# Altium project Heavy Duty Tarocco Motor Driver.PrjPCB
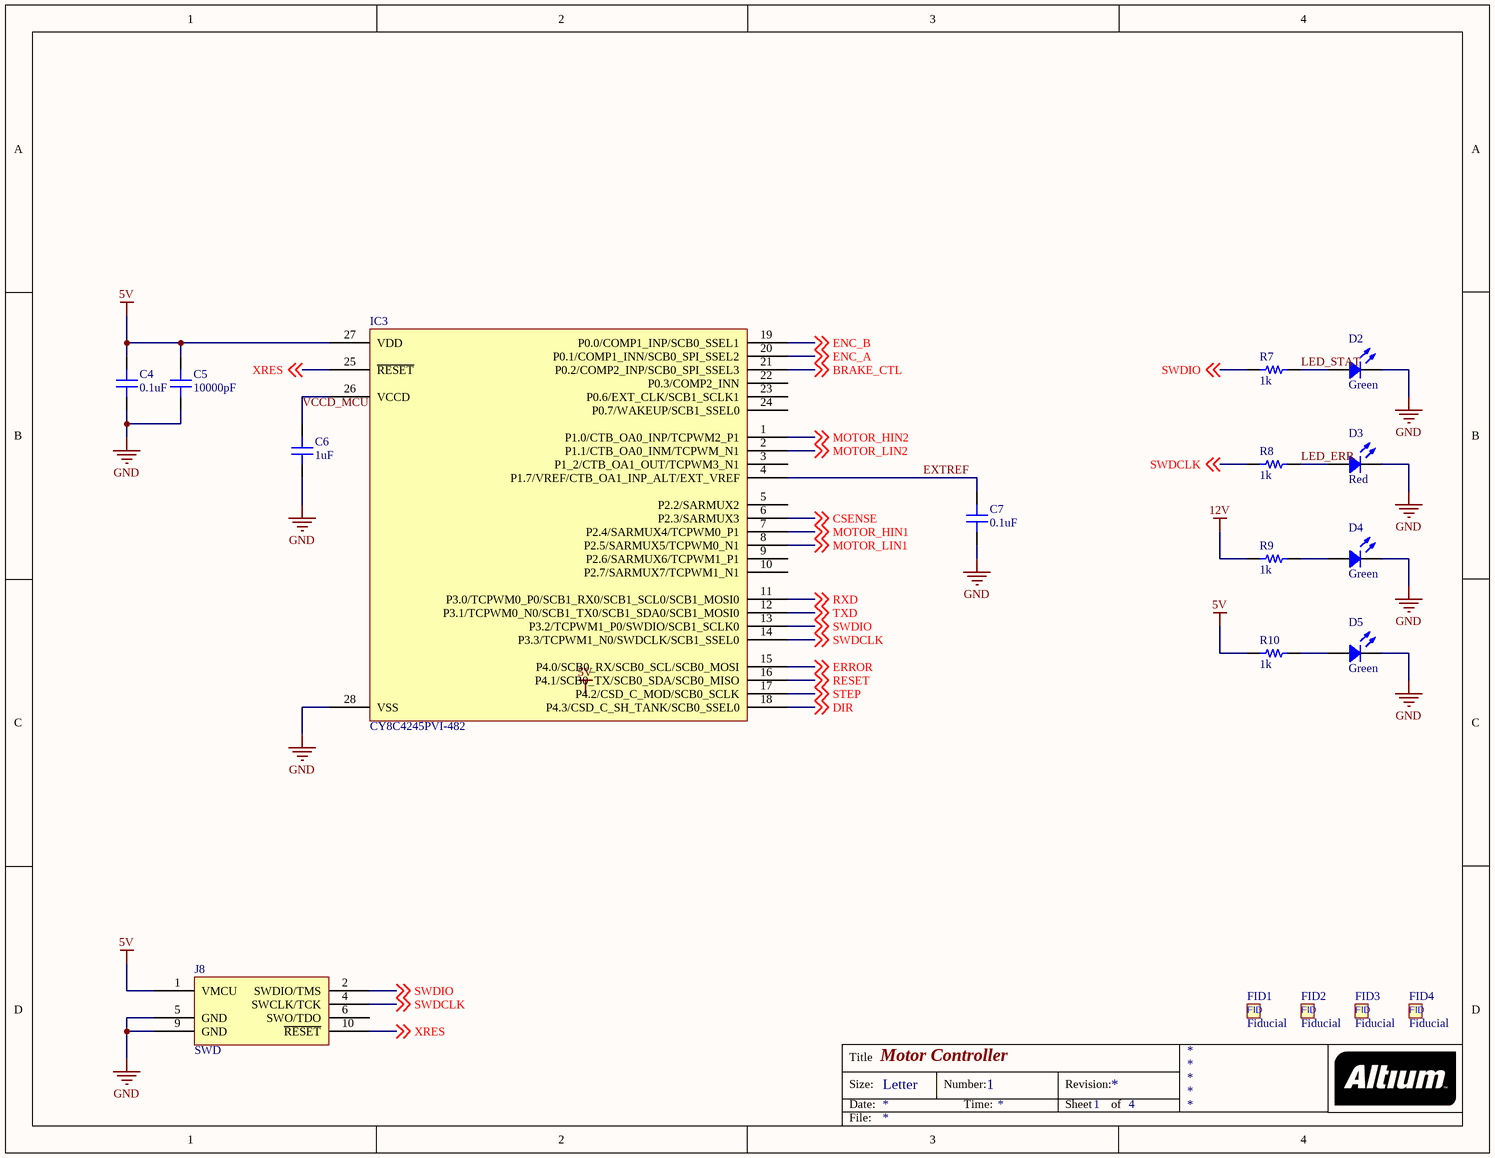
[diagram p0: Controller.SchDoc]
4 sheets, 121 parts. Net scope: global (net labels, ports and power ports of the same name join across sheets).
Board file: Motor Control Board.PcbDoc
Sheets:
  Controller.SchDoc
  HBridge.SchDoc
  Connectors.SchDoc
  Power Supply.SchDoc

## Sheet Controller.SchDoc: Motor Controller
size Letter; DocumentNumber: 1; SheetNumber: 1; SheetTotal: 4

### Parts
C4  0.1uF  [CAP 0603/1608]
C5  10000pF  [CAP 0603/1608]
C6  1uF  [CAP 0603/1608]
C7  0.1uF  [CAP 0603/1608]
D2  Green  [LED 0603/1608 GREEN]
D3  Red  [LED 0603/1608 RED]
D4  Green  [LED 0603/1608 GREEN]
D5  Green  [LED 0603/1608 GREEN]
FID1  Fiducial  [Fiducial]  (no BOM)
FID2  Fiducial  [Fiducial]  (no BOM)
FID3  Fiducial  [Fiducial]  (no BOM)
FID4  Fiducial  [Fiducial]  (no BOM)
IC3  CY8C4245PVI-482  [CYPRESS SSOP-28 210MIL]
J8  SWD  [10 Pin SWD]  (no BOM)
R7  1k  [RES 0603/1608]
R8  1k  [RES 0603/1608]
R9  1k  [RES 0603/1608]
R10  1k  [RES 0603/1608]

### Nets
5V: C4.2 C5.2 IC3.27(VDD) J8.1(VMCU) R10.1
12V: R9.1
GND: C4.1 C5.1 C6.1 C7.1 D2.2 D3.2 D4.2 D5.2 IC3.28(VSS) J8.5(GND) J8.9(GND)
BRAKE_CTL: IC3.21(P0.2/COMP2_INP/SCB0_SPI_SSEL3) ; off-sheet BRAKE_CTL
CSENSE: IC3.6(P2.3/SARMUX3) ; off-sheet CSENSE
DIR: IC3.18(P4.3/CSD_C_SH_TANK/SCB0_SSEL0) ; off-sheet DIR
ENC_A: IC3.20(P0.1/COMP1_INN/SCB0_SPI_SSEL2) ; off-sheet ENC_A
ENC_B: IC3.19(P0.0/COMP1_INP/SCB0_SSEL1) ; off-sheet ENC_B
ERROR: IC3.15(P4.0/SCB0_RX/SCB0_SCL/SCB0_MOSI) ; off-sheet ERROR
EXTREF: C7.2 IC3.4(P1.7/VREF/CTB_OA1_INP_ALT/EXT_VREF)
LED_ERR: D3.1 R8.2
LED_STAT: D2.1 R7.2
MOTOR_HIN1: IC3.7(P2.4/SARMUX4/TCPWM0_P1) ; off-sheet MOTOR_HIN1
MOTOR_HIN2: IC3.1(P1.0/CTB_OA0_INP/TCPWM2_P1) ; off-sheet MOTOR_HIN2
MOTOR_LIN1: IC3.8(P2.5/SARMUX5/TCPWM0_N1) ; off-sheet MOTOR_LIN1
MOTOR_LIN2: IC3.2(P1.1/CTB_OA0_INM/TCPWM_N1) ; off-sheet MOTOR_LIN2
RESET: IC3.16(P4.1/SCB0_TX/SCB0_SDA/SCB0_MISO) ; off-sheet RESET
RXD: IC3.11(P3.0/TCPWM0_P0/SCB1_RX0/SCB1_SCL0/SCB1_MOSI0) ; off-sheet RXD
STEP: IC3.17(P4.2/CSD_C_MOD/SCB0_SCLK) ; off-sheet STEP
SWDCLK: IC3.14(P3.3/TCPWM1_N0/SWDCLK/SCB1_SSEL0) J8.4(SWCLK/TCK) R8.1 ; off-sheet SWDCLK
SWDIO: IC3.13(P3.2/TCPWM1_P0/SWDIO/SCB1_SCLK0) J8.2(SWDIO/TMS) R7.1 ; off-sheet SWDIO
TXD: IC3.12(P3.1/TCPWM0_N0/SCB1_TX0/SCB1_SDA0/SCB1_MOSI0) ; off-sheet TXD
VCCD_MCU: C6.2 IC3.26(VCCD)
XRES: IC3.25(~{RESET}) J8.10(~{RESET}) ; off-sheet XRES
NetD4_1: D4.1 R9.2
NetD5_1: D5.1 R10.2

Not connected (* = marked no-connect by the designer): IC3 3(P1_2/CTB_OA1_OUT/TCPWM3_N1) 5(P2.2/SARMUX2) 9(P2.6/SARMUX6/TCPWM1_P1) 10(P2.7/SARMUX7/TCPWM1_N1) 22(P0.3/COMP2_INN) 23(P0.6/EXT_CLK/SCB1_SCLK1) 24(P0.7/WAKEUP/SCB1_SSEL0); J8 6(SWO/TDO)

### Notes on the sheet
- Labels drawn without touching a wire or pin: 5V
- Title
- Size:
- Date:
- Letter
- Number:
- Time:
- Revision:
- Sheet
- of
- File:
- (in symbol Fiducial) FID

### Library data of the parts
C4 = CC0603KPX7R7BB104: CAP CER 0.1UF 16V X7R 0603; Manufacturer: Yageo; TemperatureRange: -55C ~ 125C; Tolerance: 10%; Value: 0.1uF; Part Number: CC0603KPX7R7BB104; PartId: 5262; Supplier 1: Digi-Key; Supplier Part Number 1: 311-1335-2-ND; ComponentLink1Description: Datasheet; ComponentLink1URL: http://www.yageo.com/documents/recent/UPY-GPHC_X7R_6.3V-to-50V-v12.pdf; ComponentLink2Description: Digi-Key listing; ComponentLink2URL: http://digikey.com/product-detail/en/CC0603KPX7R7BB104/311-1335-2-ND/2103073; TemperatureCoefficient: X7R; Voltage: 16V; Price: 0.0043; Type: -; Device Package: 0603 (1608 Metric)
C5 = CL10B103KB8NCNC: CAP CER 10000PF 50V X7R 0603; Manufacturer: Samsung Electro-Mechanics America, Inc.; TemperatureRange: -55C ~ 125C; Tolerance: 10%; Value: 10000pF; Part Number: CL10B103KB8NCNC; PartId: 13008; Supplier 1: Digi-Key; Supplier Part Number 1: 1276-1921-2-ND; ComponentLink1Description: Datasheet; ComponentLink1URL: http://www.samsungsem.com/kr/support/library/product-catalog/__icsFiles/afieldfile/2015/11/18/MLCC.pdf; ComponentLink2Description: Digi-Key Listing; ComponentLink2URL: https://www.digikey.com/product-detail/en/samsung-electro-mechanics-america-inc/CL10B103KB8NCNC/1276-1921-2-ND/3887579; TemperatureCoefficient: X7R; Voltage: 50V; Price: 0.0032; Device Package: 0603 (1608 Metric)
C6 = CC0603ZRY5V7BB105: CAP CER 1UF 16V Y5V 0603; Manufacturer: Yageo; TemperatureRange: -30C ~ 85C; TemperatureCoefficient: Y5V (F); Tolerance: -20%, +80%; Value: 1uF; Part Number: CC0603ZRY5V7BB105; PartId: 13115; Supplier 1: Digi-Key; Supplier Part Number 1: 311-1372-2-ND; ComponentLink1Description: Datasheet; ComponentLink1URL: http://www.yageo.com/documents/recent/UPY-GPHC_Y5V_6.3V-to-50V_6.pdf; ComponentLink2Description: Digi-Key Listing; ComponentLink2URL: https://www.digikey.com/product-detail/en/yageo/CC0603ZRY5V7BB105/311-1372-2-ND/2103110; Voltage: 16V; Price: 0.0063; Device Package: 0603 (1608 Metric)
C7 = CC0603JRX7R8BB104: CAP CER 0.1UF 25V X7R 0603; Manufacturer: Yageo; TemperatureRange: -55C ~ 125C; Tolerance: 5%; Value: 0.1uF; Part Number: CC0603JRX7R8BB104; PartId: 5305; Supplier 1: Digi-Key; Supplier Part Number 1: 311-1777-2-ND; ComponentLink1Description: Datasheet; ComponentLink1URL: http://www.yageo.com/documents/recent/UPY-GPHC_X7R_6.3V-to-50V-v12.pdf; ComponentLink2Description: Digi-Key listing; ComponentLink2URL: http://digikey.com/product-detail/en/CC0603JRX7R8BB104/311-1777-2-ND/5195186; TemperatureCoefficient: X7R; Voltage: 25V; Price: 0.0079; Type: -; Device Package: 0603 (1608 Metric)
D2 D4 D5 = LTST-C191KGKT: LED GREEN CLEAR 0603 SMD; Manufacturer: Lite-On Inc.; Type: Surface Mount; Millicandela: 35mcd; Voltage Forward: 2V; Current (Test): 20mA; Viewing Angle: 130; Value: Green; Part Number: LTST-C191KGKT; PartId: 7051; Supplier 1: Digi-Key; Supplier Part Number 1: 160-1446-2-ND; ComponentLink1Description: Datasheet; ComponentLink1URL: http://optoelectronics.liteon.com/upload/download/DS22-2000-228/S_110_LTST-C191KGKT.pdf; ComponentLink2Description: Digi-Key Listing; ComponentLink2URL: http://www.digikey.ca/product-detail/en/LTST-C191KGKT/160-1446-2-ND/386835; Price: 0.0521; Device Package: 0603 (1608 Metric); Colour: Green; Lens Transparency: Clear
D3 = LTST-C191KRKT: LED RED CLEAR 0603 SMD; Manufacturer: Lite-On Inc.; Value: Green; Millicandela: 54mcd; Voltage Forward: 2V; Current (Test): 20mA; Viewing Angle: 130; Part Number: LTST-C191KRKT; PartId: 7050; Supplier 1: Digi-Key; Supplier Part Number 1: 160-1447-2-ND; ComponentLink1Description: Datasheet; ComponentLink1URL: http://optoelectronics.liteon.com/upload/download/DS22-2000-223/S_110_LTST-C191KRKT.pdf; ComponentLink2Description: Digi-Key Listing; ComponentLink2URL: http://www.digikey.ca/product-detail/en/LTST-C191KRKT/160-1447-2-ND/386837; Price: 0.0521; Device Package: 0603 (1608 Metric); Colour: Red; Lens Transparency: Clear
IC3 = CY8C4245PVI-482: IC MCU 32BIT 32KB FLASH 28SSOP; Manufacturer: Cypress Semiconductor Corp; Core Processor: ARM Cortex-M0; Core Size: 32-Bit; Speed: 48MHz; Connectivity: IC, IrDA, LIN, Microwire, SmartCard, SPI, SSP, UART/USART; Peripherals: Brown-out Detect/Reset, CapSense, LCD, LVD, POR, PWM, WDT; Number Of IO: 22; Program Memory Size: 32KB (32K x 8); Ram Size: 4K x 8; Voltage: 1.71 V ~ 5.5 V; Data Converters: A/D 8x12b; Oscillator Type: Internal; Part Number: CY8C4245PVI-482; PartId: 21202; Supplier 1: Digi-Key; Supplier Part Number 1: CY8C4245PVI-482-ND; ComponentLink1Description: Datasheet; ComponentLink1URL: http://www.cypress.com/?docID=46322; ComponentLink2Description: Digi-Key Listing; ComponentLink2URL: https://www.digikey.com/product-detail/en/cypress-semiconductor-corp/CY8C4245PVI-482/CY8C4245PVI-482-ND/4047448; Price: 3.75; Device Package: 28-SSOP (0.209", 5.30mm Width); Series: PSOC® 4 CY8C42xx; Program Memory Type: FLASH
R7-R10 = ERJ-3GEYJ102V: RES SMD 1K OHM 5% 1/10W 0603; Manufacturer: Panasonic Electronic Components; TemperatureRange: -55C ~ 155C; TemperatureCoefficient: 200ppm/C; PowerRating: 0.1W, 1/10W; Value: 1k; Part Number: ERJ-3GEYJ102V; PartId: 11176; Supplier 1: Digi-Key; Supplier Part Number 1: P1.0KGTR-ND; ComponentLink1Description: Datasheet; ComponentLink1URL: http://industrial.panasonic.com/www-cgi/jvcr13pz.cgi?E+PZ+3+AOA0001+ERJ3GEYJ102V+7+WW; ComponentLink2Description: Digi-Key Listing; ComponentLink2URL: https://www.digikey.com/product-detail/en/panasonic-electronic-components/ERJ-3GEYJ102V/P1.0KGTR-ND/68472; Tolerance: 5%; Price: 0.002; Device Package: 0603 (1608 Metric)

## Sheet HBridge.SchDoc: H Bridge
size Letter; DocumentNumber: 2; SheetNumber: 2; SheetTotal: 4
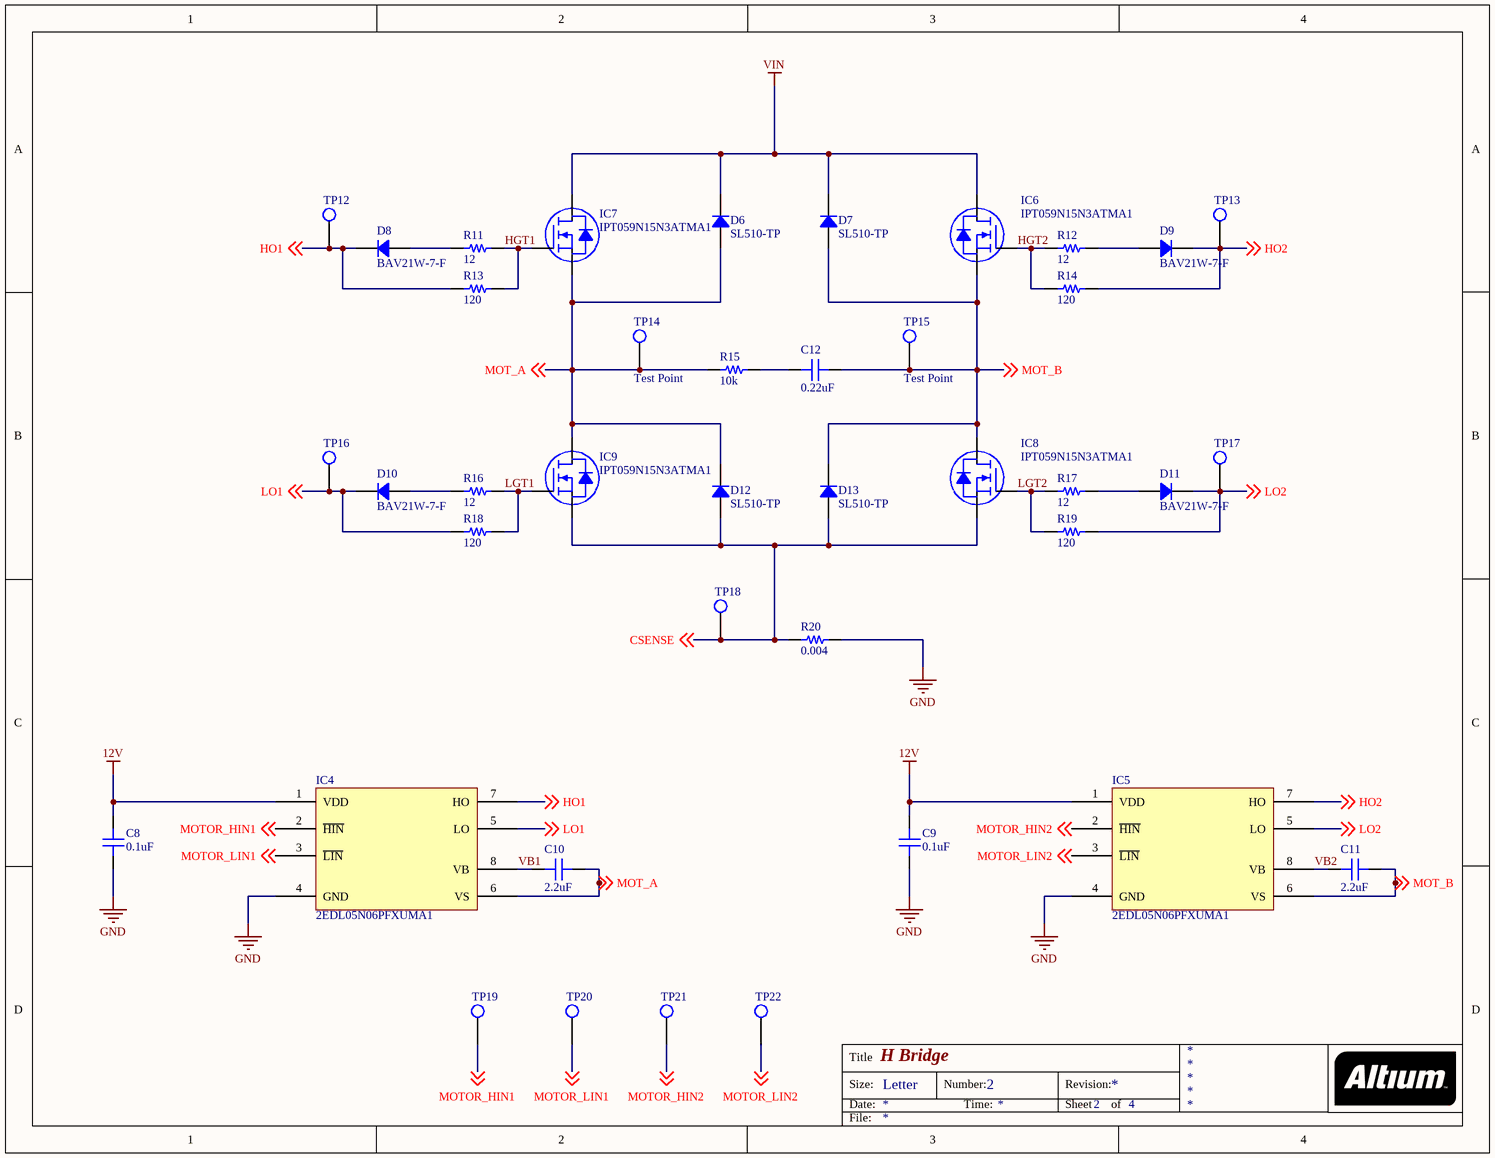
[diagram p1: HBridge.SchDoc]

### Parts
C8  0.1uF  [CAP 0603/1608]
C9  0.1uF  [CAP 0603/1608]
C10  2.2uF  [CAP 0805/2012]
C11  2.2uF  [CAP 0805/2012]
C12  0.22uF  [CAP 1206/3216]
D6  SL510-TP  [ST DO214AB SMC]
D7  SL510-TP  [ST DO214AB SMC]
D8  BAV21W-7-F  [SOD-123]
D9  BAV21W-7-F  [SOD-123]
D10  BAV21W-7-F  [SOD-123]
D11  BAV21W-7-F  [SOD-123]
D12  SL510-TP  [ST DO214AB SMC]
D13  SL510-TP  [ST DO214AB SMC]
IC4  2EDL05N06PFXUMA1  [Infineon PG-DSO-8]
IC5  2EDL05N06PFXUMA1  [Infineon PG-DSO-8]
IC6  IPT059N15N3ATMA1  [INFINEON PG-HSOF-8-1]
IC7  IPT059N15N3ATMA1  [INFINEON PG-HSOF-8-1]
IC8  IPT059N15N3ATMA1  [INFINEON PG-HSOF-8-1]
IC9  IPT059N15N3ATMA1  [INFINEON PG-HSOF-8-1]
R11  12  [RES 1206/3216]
R12  12  [RES 1206/3216]
R13  120  [RES 1206/3216]
R14  120  [RES 1206/3216]
R15  10k  [RES 0805/2012]
R16  12  [RES 1206/3216]
R17  12  [RES 1206/3216]
R18  120  [RES 1206/3216]
R19  120  [RES 1206/3216]
R20  0.004  [STACKPOLE CSR2512]
TP12  Test Point  [Test Point]  (value not drawn)  (no BOM)
TP13  Test Point  [Test Point]  (value not drawn)  (no BOM)
TP14  Test Point  [Test Point]  (no BOM)
TP15  Test Point  [Test Point]  (no BOM)
TP16  Test Point  [Test Point]  (value not drawn)  (no BOM)
TP17  Test Point  [Test Point]  (value not drawn)  (no BOM)
TP18  Test Point  [Test Point]  (value not drawn)  (no BOM)
TP19  Test Point  [Test Point]  (value not drawn)  (no BOM)
TP20  Test Point  [Test Point]  (value not drawn)  (no BOM)
TP21  Test Point  [Test Point]  (value not drawn)  (no BOM)
TP22  Test Point  [Test Point]  (value not drawn)  (no BOM)

### Nets
12V: C8.2 C9.2 IC4.1(VDD) IC5.1(VDD)
GND: C8.1 C9.1 IC4.4(GND) IC5.4(GND) R20.2
VIN: D6.2 D7.2 IC6.D IC7.D
CSENSE: D12.1 D13.1 IC8.S IC9.S R20.1 TP18.1(TP) ; off-sheet CSENSE
HGT1: IC7.G R11.2 R13.2
HGT2: IC6.G R12.1 R14.1
HO1: D8.2 IC4.7(HO) R13.1 TP12.1(TP) ; off-sheet HO1
HO2: D9.2 IC5.7(HO) R14.2 TP13.1(TP) ; off-sheet HO2
LGT1: IC9.G R16.2 R18.2
LGT2: IC8.G R17.1 R19.1
LO1: D10.2 IC4.5(LO) R18.1 TP16.1(TP) ; off-sheet LO1
LO2: D11.2 IC5.5(LO) R19.2 TP17.1(TP) ; off-sheet LO2
MOT_A: C10.1 D6.1 D12.2 IC4.6(VS) IC7.S IC9.D R15.1 TP14.1(TP) ; off-sheet MOT_A
MOT_B: C11.1 C12.2 D7.1 D13.2 IC5.6(VS) IC6.S IC8.D TP15.1(TP) ; off-sheet MOT_B
MOTOR_HIN1: IC4.2(~{HIN}) TP19.1(TP) ; off-sheet MOTOR_HIN1
MOTOR_HIN2: IC5.2(~{HIN}) TP21.1(TP) ; off-sheet MOTOR_HIN2
MOTOR_LIN1: IC4.3(~{LIN}) TP20.1(TP) ; off-sheet MOTOR_LIN1
MOTOR_LIN2: IC5.3(~{LIN}) TP22.1(TP) ; off-sheet MOTOR_LIN2
VB1: C10.2 IC4.8(VB)
VB2: C11.2 IC5.8(VB)
NetC12_1: C12.1 R15.2
NetD8_1: D8.1 R11.1
NetD9_1: D9.1 R12.2
NetD10_1: D10.1 R16.1
NetD11_1: D11.1 R17.2

### Notes on the sheet
- Title
- Size:
- Date:
- Letter
- Number:
- Time:
- Revision:
- Sheet
- of
- File:

### Library data of the parts
C8 C9 = CC0603KPX7R7BB104: as C4 on sheet Controller; Value: 0.1uF; Part Number: CC0603KPX7R7BB104; PartId: 5262; Supplier 1: Digi-Key; Supplier Part Number 1: 311-1335-2-ND; ComponentLink1Description: Datasheet; ComponentLink1URL: http://www.yageo.com/documents/recent/UPY-GPHC_X7R_6.3V-to-50V-v12.pdf; ComponentLink2Description: Digi-Key listing; ComponentLink2URL: http://digikey.com/product-detail/en/CC0603KPX7R7BB104/311-1335-2-ND/2103073; TemperatureCoefficient: X7R; Voltage: 16V; Price: 0.0043; Type: -; Device Package: 0603 (1608 Metric)
C10 C11 = GRM219C81E225KE15D: CAP CER 2.2UF 25V X6S 0805; Manufacturer: Murata Electronics North America; TemperatureRange: -55C ~ 105C; Tolerance: 10%; Value: 2.2uF; Part Number: GRM219C81E225KE15D; PartId: 13974; Supplier 1: Digi-Key; Supplier Part Number 1: 490-7206-2-ND; ComponentLink1Description: Datasheet; ComponentLink1URL: http://www.murata.com/~/media/webrenewal/support/library/catalog/products/capacitor/mlcc/c02e.pdf; ComponentLink2Description: Digi-Key Listing; ComponentLink2URL: https://www.digikey.com/product-detail/en/murata-electronics-north-america/GRM219C81E225KE15D/490-7206-2-ND/3900464; TemperatureCoefficient: X6S; Voltage: 25V; Price: 0.0334; Device Package: 0805 (2012 Metric)
C12 = C3216X7T2E224K160AA: CAP CER 0.22UF 250V X7T 1206; Manufacturer: TDK Corporation; TemperatureRange: -55C ~ 125C; Tolerance: 10%; Value: 0.22uF; Part Number: C3216X7T2E224K160AA; PartId: 14974; Supplier 1: Digi-Key; Supplier Part Number 1: 445-7756-2-ND; ComponentLink1Description: Datasheet; ComponentLink1URL: https://product.tdk.com/info/en/catalog/datasheets/mlcc_commercial_midvoltage_en.pdf; ComponentLink2Description: Digi-Key Listing; ComponentLink2URL: https://www.digikey.com/product-detail/en/tdk-corporation/C3216X7T2E224K160AA/445-7756-2-ND/2733191; TemperatureCoefficient: X7T; Voltage: 250V; Price: 0.099; Device Package: 1206 (3216 Metric)
D6 D7 D12 D13 = SL510-TP: DIODE SCHOTTKY 100V 5A DO214AB; Manufacturer: Micro Commercial Co; Current Reverse Leakage @ Vr: 500uA @ 100V; Voltage Forward (Vf): 700mV @ 5A; Part Number: SL510-TP; PartId: 27860; Supplier 1: Digi-Key; Supplier Part Number 1: SL510-TPMSCT-ND; ComponentLink1Description: Datasheet; ComponentLink1URL: http://www.mccsemi.com/up_pdf/SL54~SL510(DO-214AB)-A.pdf; ComponentLink2Description: Digi-Key Listing; ComponentLink2URL: https://www.digikey.com/product-detail/en/micro-commercial-co/SL510-TP/SL510-TPMSCT-ND/6004849; Junction Operating Temperature: -55C ~ 150C; Price: 0.74; Type: Schottky; Device Package: DO-214AB, SMC; Voltage DC Reverse (Vr): 100V; Current Rectified: 5A
D8-D11 = BAV21W-7-F: DIODE GEN PURP 200V 200MA SOD123; Manufacturer: Diodes Incorporated; Type: Standard; Current Reverse Leakage @ Vr: 100nA @ 200V; Reverse Recovery Time (trr): 50ns; Voltage Forward (Vf): 1.25V @ 200mA; Part Number: BAV21W-7-F; PartId: 14590; Supplier 1: Digi-Key; Supplier Part Number 1: BAV21W-FDITR-ND; ComponentLink1Description: Datasheet; ComponentLink1URL: http://www.diodes.com/_files/datasheets/ds12024.pdf; ComponentLink2Description: Digi-Key Listing; ComponentLink2URL: https://www.digikey.com/product-detail/en/diodes-incorporated/BAV21W-7-F/BAV21W-FDITR-ND/717710; Junction Operating Temperature: -65C ~ 150C; Price: 0.0318; Device Package: SOD-123; Voltage DC Reverse (Vr): 200V; Current Rectified: 200mA
IC4 IC5 = 2EDL05N06PFXUMA1: IC DRIVER GATE HALF BRIDGE 8DSO; Manufacturer: Infineon Technologies; Voltage - Supply: 10 V ~ 20 V; Part Number: 2EDL05N06PFXUMA1; PartId: 21206; Supplier 1: Digi-Key; Supplier Part Number 1: 2EDL05N06PFXUMA1TR-ND; ComponentLink1Description: Datasheet; ComponentLink1URL: http://www.infineon.com/dgdl/Infineon-2EDL05x06xx-DS-v02_05-EN.pdf?fileId=db3a30433e30e4bf013e3c649ffd6c8b; ComponentLink2Description: Digi-Key Listing; ComponentLink2URL: http://www.digikey.com/product-detail/en/infineon-technologies/2EDL05N06PFXUMA1/2EDL05N06PFXUMA1TR-ND/4571868?; Price: 0.5782; Device Package: 8-SOIC (0.154", 3.90mm Width)
IC6-IC9 = IPT059N15N3ATMA1: MOSFET N-CH 150V 155A 8HSOF; Manufacturer: Infineon Technologies; Rds On (Max) at Id, Vgs: 5.9 mOhm @ 150A, 10V; Vgs(th) (Max) at Id: 4V @ 270uA; Current Continuous Drain: 155A (Tc); Part Number: IPT059N15N3ATMA1; PartId: 21207; Supplier 1: Digi-Key; Supplier Part Number 1: IPT059N15N3ATMA1CT-ND; ComponentLink1Description: Datasheet; ComponentLink1URL: http://www.infineon.com/dgdl/IPT059N15N3+G_Rev1.1.pdf?folderId=db3a304326623792012669f6bee2224b&fileId=db3a30433e9d5d11013e9e62778d0185; ComponentLink2Description: Digi-Key Listing; ComponentLink2URL: http://www.digikey.ca/product-detail/en/infineon-technologies/IPT059N15N3ATMA1/IPT059N15N3ATMA1CT-ND/4571880; Price: 9.27; Type: N-Channel; Device Package: 8-PowerSFN; Drain to Source Voltage (Vdss): 150V; Features: -
R11 R12 R16 R17 = ERJ-8GEYJ120V: RES SMD 12 OHM 5% 1/4W 1206; Manufacturer: Panasonic Electronic Components; TemperatureRange: -55C ~ 155C; TemperatureCoefficient: 200ppm/C; PowerRating: 0.25W, 1/4W; Value: 12; Part Number: ERJ-8GEYJ120V; PartId: 11899; Supplier 1: Digi-Key; Supplier Part Number 1: P12ETR-ND; ComponentLink1Description: Datasheet; ComponentLink1URL: http://industrial.panasonic.com/www-cgi/jvcr13pz.cgi?E+PZ+3+AOA0001+ERJ8GEYJ120V+7+WW; ComponentLink2Description: Digi-Key Listing; ComponentLink2URL: https://www.digikey.com/product-detail/en/panasonic-electronic-components/ERJ-8GEYJ120V/P12ETR-ND/16119; Tolerance: 5%; Price: 0.0045; Device Package: 1206 (3216 Metric)
R13 R14 R18 R19 = ERJ-8GEYJ121V: RES SMD 120 OHM 5% 1/4W 1206; Manufacturer: Panasonic Electronic Components; TemperatureRange: -55C ~ 155C; TemperatureCoefficient: 200ppm/C; PowerRating: 0.25W, 1/4W; Value: 120; Part Number: ERJ-8GEYJ121V; PartId: 11834; Supplier 1: Digi-Key; Supplier Part Number 1: P120ETR-ND; ComponentLink1Description: Datasheet; ComponentLink1URL: http://industrial.panasonic.com/www-cgi/jvcr13pz.cgi?E+PZ+3+AOA0001+ERJ8GEYJ121V+7+WW; ComponentLink2Description: Digi-Key Listing; ComponentLink2URL: https://www.digikey.com/product-detail/en/panasonic-electronic-components/ERJ-8GEYJ121V/P120ETR-ND/1567; Tolerance: 5%; Price: 0.0045; Device Package: 1206 (3216 Metric)
R15 = ERJ-6GEYJ103V: RES SMD 10K OHM 5% 1/8W 0805; Manufacturer: Panasonic Electronic Components; TemperatureRange: -55C ~ 155C; TemperatureCoefficient: 200ppm/C; PowerRating: 0.125W, 1/8W; Value: 10k; Part Number: ERJ-6GEYJ103V; PartId: 11441; Supplier 1: Digi-Key; Supplier Part Number 1: P10KATR-ND; ComponentLink1Description: Datasheet; ComponentLink1URL: http://industrial.panasonic.com/www-cgi/jvcr13pz.cgi?E+PZ+3+AOA0001+ERJ6GEYJ103V+7+WW; ComponentLink2Description: Digi-Key Listing; ComponentLink2URL: https://www.digikey.com/product-detail/en/panasonic-electronic-components/ERJ-6GEYJ103V/P10KATR-ND/83062; Tolerance: 5%; Price: 0.0032; Device Package: 0805 (2012 Metric)
R20 = ERJ-MP4MF4M0U: RES SMD 0.004 OHM 1% 1W 2512; Manufacturer: Panasonic Electronic Components; TemperatureRange: -65C ~ 170C; TemperatureCoefficient: 75ppm/C; Value: 0.004; Part Number: ERJ-MP4MF4M0U; PartId: 21258; Supplier 1: Digi-Key; Supplier Part Number 1: P19396TR-ND; ComponentLink1Description: Datasheet; ComponentLink1URL: https://industrial.panasonic.com/cdbs/www-data/pdf/RDA0000/AOA0000C263.pdf; ComponentLink2Description: Digi-Key Listing; ComponentLink2URL: https://www.digikey.com/product-detail/en/panasonic-electronic-components/ERJ-MP4MF4M0U/P19396TR-ND/6096725; Tolerance: 1%; PowerRating: 1W; Price: 0.1201; Device Package: 2512 (6432 Metric)

## Sheet Connectors.SchDoc: Connectors
size Letter; DocumentNumber: 3; SheetNumber: 3; SheetTotal: 4
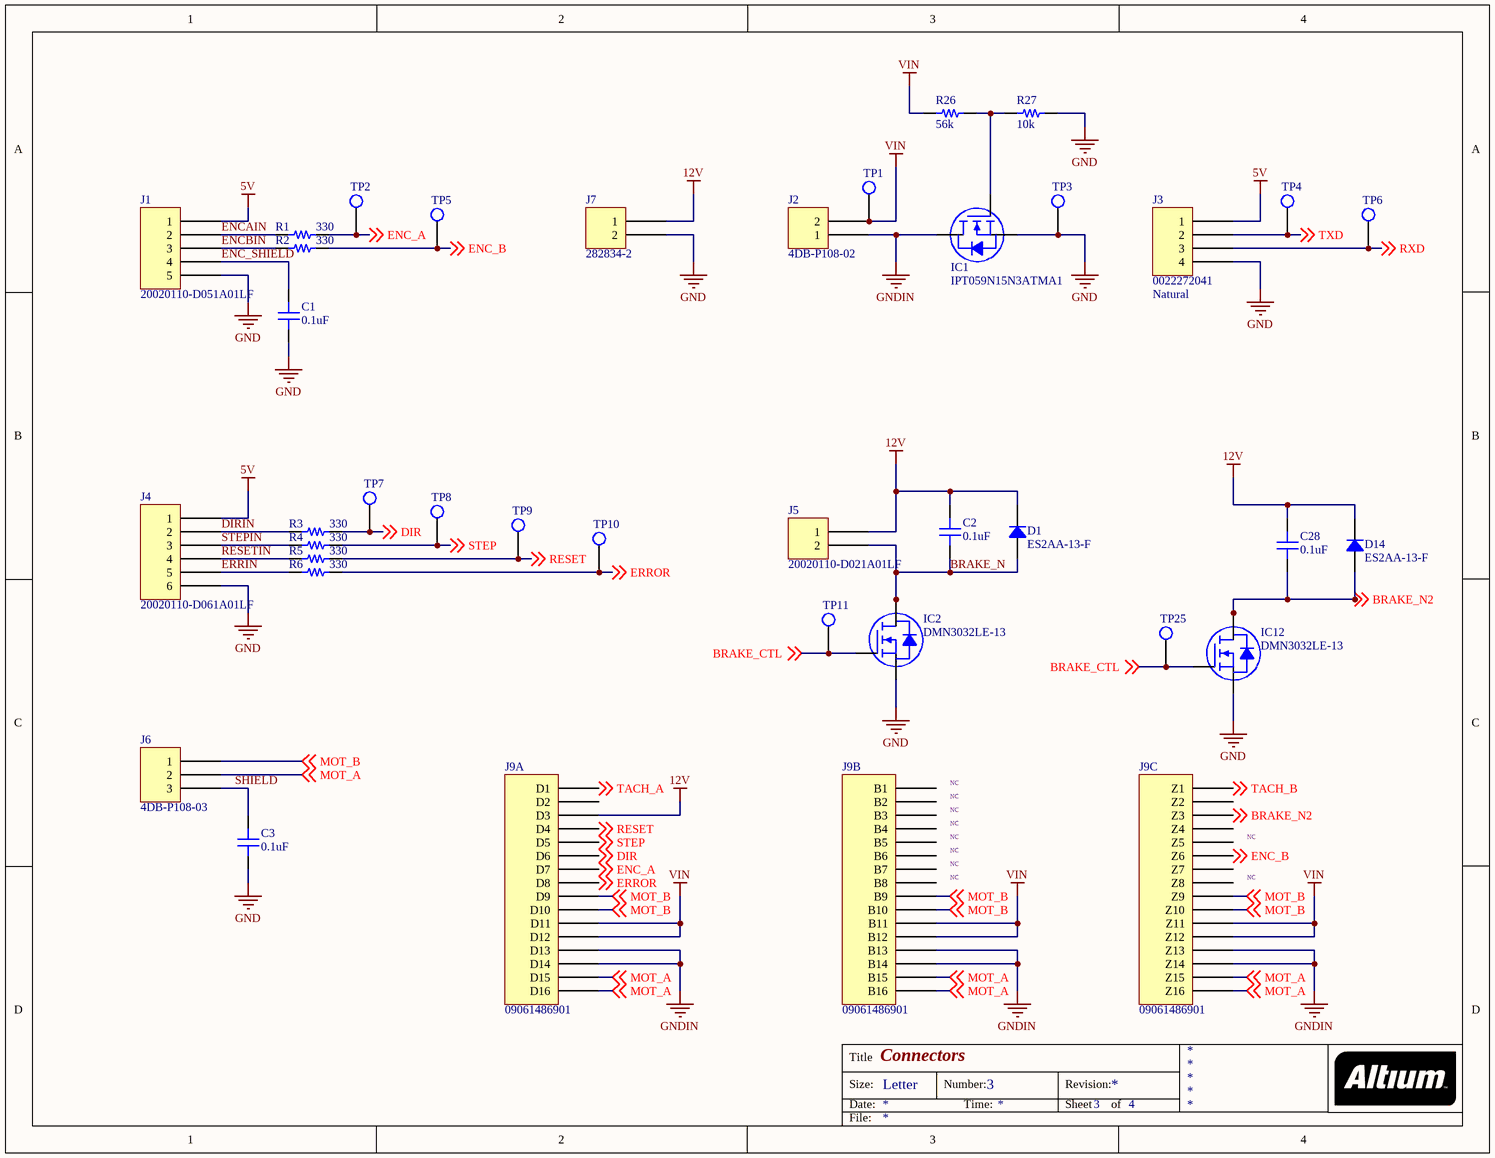
[diagram p2: Connectors.SchDoc]

### Parts
C1  0.1uF  [CAP 0805/2012]
C2  0.1uF  [CAP 0805/2012]
C3  0.1uF  [CAP 0805/2012]
C28  0.1uF  [CAP 0805/2012]
D1  ES2AA-13-F  [DO214AC SMA]
D14  ES2AA-13-F  [DO214AC SMA]
IC1  IPT059N15N3ATMA1  [INFINEON PG-HSOF-8-1]
IC2  DMN3032LE-13  [DIODES SOT-223]
IC12  DMN3032LE-13  [DIODES SOT-223]
J1  20020110-D051A01LF  [FCI 06-381-5PIN]
J2  4DB-P108-02  [TE 4DB-P108-02]
J3  0022272041  Colour: Natural  [MOLEX KK 0022272041]
J4  20020110-D061A01LF  [FCI 06-381-6PIN]
J5  20020110-D021A01LF  [FCI 06-381-2PIN]
J6  4DB-P108-03  [TE 4DB-P108-03]
J7  282834-2  [TE 282834-2]
J9  09061486901  [HARTING 09061486901]  (parts A,B,C of 3)
R1  330  [RES 0603/1608]
R2  330  [RES 0603/1608]
R3  330  [RES 0603/1608]
R4  330  [RES 0603/1608]
R5  330  [RES 0603/1608]
R6  330  [RES 0603/1608]
R26  56k  [RES 0603/1608]
R27  10k  [RES 0603/1608]
TP1  Test Point  [Test Point]  (value not drawn)  (no BOM)
TP2  Test Point  [Test Point]  (value not drawn)  (no BOM)
TP3  Test Point  [Test Point]  (value not drawn)  (no BOM)
TP4  Test Point  [Test Point]  (value not drawn)  (no BOM)
TP5  Test Point  [Test Point]  (value not drawn)  (no BOM)
TP6  Test Point  [Test Point]  (value not drawn)  (no BOM)
TP7  Test Point  [Test Point]  (value not drawn)  (no BOM)
TP8  Test Point  [Test Point]  (value not drawn)  (no BOM)
TP9  Test Point  [Test Point]  (value not drawn)  (no BOM)
TP10  Test Point  [Test Point]  (value not drawn)  (no BOM)
TP11  Test Point  [Test Point]  (value not drawn)  (no BOM)
TP25  Test Point  [Test Point]  (value not drawn)  (no BOM)

### Nets
5V: J1.1 J3.1 J4.1
12V: C2.2 C28.2 D1.2 D14.2 J5.1 J7.1 J9.D3
GND: C1.1 C3.1 IC1.S IC2.3(S) IC12.3(S) J1.5 J3.4 J4.6 J7.2 R27.2 TP3.1(TP)
GNDIN: IC1.D J2.1 J9.B13 J9.B14 J9.D13 J9.D14 J9.Z13 J9.Z14
VIN: J2.2 J9.B11 J9.B12 J9.D11 J9.D12 J9.Z11 J9.Z12 R26.1 TP1.1(TP)
BRAKE_CTL: IC2.1(G) IC12.1(G) TP11.1(TP) TP25.1(TP) ; off-sheet BRAKE_CTL
BRAKE_N: C2.1 D1.1 IC2.2(D) IC2.4(D) J5.2
BRAKE_N2: C28.1 D14.1 IC12.2(D) IC12.4(D) J9.Z3 ; off-sheet BRAKE_N2
DIR: J9.D6 R3.2 TP7.1(TP) ; off-sheet DIR
DIRIN: J4.2 R3.1
ENC_A: J9.D7 R1.2 TP2.1(TP) ; off-sheet ENC_A
ENC_B: J9.Z6 R2.2 TP5.1(TP) ; off-sheet ENC_B
ENC_SHIELD: C1.2 J1.4
ENCAIN: J1.2 R1.1
ENCBIN: J1.3 R2.1
ERRIN: J4.5 R6.1
ERROR: J9.D8 R6.2 TP10.1(TP) ; off-sheet ERROR
MOT_A: J6.2 J9.B15 J9.B16 J9.D15 J9.D16 J9.Z15 J9.Z16 ; off-sheet MOT_A
MOT_B: J6.1 J9.B9 J9.B10 J9.D9 J9.D10 J9.Z9 J9.Z10 ; off-sheet MOT_B
RESET: J9.D4 R5.2 TP9.1(TP) ; off-sheet RESET
RESETIN: J4.4 R5.1
RXD: J3.3 TP6.1(TP) ; off-sheet RXD
SHIELD: C3.2 J6.3
STEP: J9.D5 R4.2 TP8.1(TP) ; off-sheet STEP
STEPIN: J4.3 R4.1
TACH_A: J9.D1 ; off-sheet TACH_A
TACH_B: J9.Z1 ; off-sheet TACH_B
TXD: J3.2 TP4.1(TP) ; off-sheet TXD
NetIC1_G: IC1.G R26.2 R27.1

Not connected (* = marked no-connect by the designer): J9 B1 B2 B3 B4 B5 B6 B7 B8 D2 Z2 Z4 Z5 Z7 Z8

### Notes on the sheet
- NC
- Title
- Size:
- Date:
- Letter
- Number:
- Time:
- Revision:
- Sheet
- of
- File:

### Library data of the parts
C1-C3 C28 = C2012X5R2A104K125AA: CAP CER 0.1UF 100V X5R 0805; Manufacturer: TDK Corporation; TemperatureRange: -55C ~ 85C; Tolerance: 10%; Value: 0.1uF; Part Number: C2012X5R2A104K125AA; PartId: 4491; Supplier 1: Digi-Key; Supplier Part Number 1: 445-14435-2-ND; ComponentLink1Description: Datasheet; ComponentLink1URL: https://product.tdk.com/info/en/catalog/datasheets/mlcc_commercial_midvoltage_en.pdf; ComponentLink2Description: Digi-Key listing; ComponentLink2URL: http://digikey.com/product-detail/en/C2012X5R2A104K125AA/445-14435-2-ND/3951671; TemperatureCoefficient: X5R; Voltage: 100V; Price: 0.0473; Type: -; Device Package: 0805 (2012 Metric)
D1 D14 = ES2AA-13-F: DIODE GEN PURP 50V 2A SMA; Manufacturer: Diodes Incorporated; Type: Standard; Current Reverse Leakage @ Vr: 5uA @ 50V; Reverse Recovery Time (trr): 25ns; Voltage Forward (Vf): 920mV @ 2A; Part Number: ES2AA-13-F; PartId: 16339; Supplier 1: Digi-Key; Supplier Part Number 1: ES2AA-FDITR-ND; ComponentLink1Description: Datasheet; ComponentLink1URL: http://www.diodes.com/_files/datasheets/ds14002.pdf; ComponentLink2Description: Digi-Key Listing; ComponentLink2URL: https://www.digikey.com/product-detail/en/diodes-incorporated/ES2AA-13-F/ES2AA-FDITR-ND/765412; Junction Operating Temperature: -55C ~ 150C; Price: 0.124; Device Package: DO-214AC, SMA; Voltage DC Reverse (Vr): 50V; Current Rectified: 2A
IC1 = IPT059N15N3ATMA1: as IC6 on sheet HBridge; Part Number: IPT059N15N3ATMA1; PartId: 21207; Supplier 1: Digi-Key; Supplier Part Number 1: IPT059N15N3ATMA1CT-ND; ComponentLink1Description: Datasheet; ComponentLink1URL: http://www.infineon.com/dgdl/IPT059N15N3+G_Rev1.1.pdf?folderId=db3a304326623792012669f6bee2224b&fileId=db3a30433e9d5d11013e9e62778d0185; ComponentLink2Description: Digi-Key Listing; ComponentLink2URL: http://www.digikey.ca/product-detail/en/infineon-technologies/IPT059N15N3ATMA1/IPT059N15N3ATMA1CT-ND/4571880; Price: 9.27; Type: N-Channel; Device Package: 8-PowerSFN; Drain to Source Voltage (Vdss): 150V; Features: -
IC2 IC12 = DMN3032LE-13: MOSFET N-CH 30V 5.6A SOT223; Manufacturer: Diodes Incorporated; Rds On (Max) at Id, Vgs: 29 mOhm @ 3.2A, 10V; Vgs(th) (Max) at Id: 2V @ 250uA; Gate Charge (Qg): 11.3nC @ 10V; Input Capacitance (Ciss) at Vds: 498pF @ 15V; Power - Max: 1.8W; Current Continuous Drain: 5.6A (Ta); Part Number: DMN3032LE-13; PartId: 8090; Supplier 1: Digi-Key; Supplier Part Number 1: DMN3032LE-13DITR-ND; ComponentLink1Description: Datasheet; ComponentLink1URL: http://diodes.com/_files/datasheets/DMN3032LE.pdf; ComponentLink2Description: Digi-Key Listing; ComponentLink2URL: http://www.digikey.com/product-detail/en/DMN3032LE-13/DMN3032LE-13DITR-ND/4747642; Price: 0.1937; Type: MOSFET N-Channel, Metal Oxide; Device Package: TO-261-4, TO-261AA; Drain to Source Voltage (Vdss): 30V; Features: Standard
J1 = 20020110-D051A01LF: TERM BLOCK HDR 5POS R/A 3.81MM; Manufacturer: FCI; TemperatureRange: -40C ~ 115C; Voltage: 300V; Pitch: 0.150" (3.81mm); Number Of Positions: 5; Number Of Levels: 1; Part Number: 20020110-D051A01LF; PartId: 7788; Supplier 1: Digi-Key; Supplier Part Number 1: 609-3822-ND; ComponentLink1Description: Datasheet; ComponentLink1URL: http://portal.fciconnect.com/Comergent//fci/drawing/20020110.pdf; ComponentLink2Description: Digi-Key Listing; ComponentLink2URL: http://www.digikey.ca/product-detail/en/20020110-D051A01LF/609-3822-ND/2261276; Price: 1.33; Type: Through Hole; Colour: Green; Orientation: 90, Right Angle; Positions Per Level: 5
J2 = 4DB-P108-02: CONN BARRIER STRIP 2CIRC 0.325"; Manufacturer: TE Connectivity AMP Connectors; Number Of Circuits: 2; Pitch: 0.325" (8.26mm); Current Rating: 20A; Voltage: 150V; Wire Gauge: 12-22 AWG; Top Termination: Screws with Captive Plate; Bottom Termination: PC Pin; Barrier Type: 2 Wall (Dual); Part Number: 4DB-P108-02; PartId: 27456; Supplier 1: Digi-Key; Supplier Part Number 1: A98472-ND; Supplier 2: Digi-Key; Supplier Part Number 2: A98472-ND; Supplier 3: Digi-Key; Supplier Part Number 3: A98472-ND; Supplier 4: Digi-Key; Supplier Part Number 4: A98472-ND; ComponentLink1Description: Datasheet; ComponentLink1URL: http://www.te.com/commerce/DocumentDelivery/DDEController?Action=srchrtrv&DocNm=2-1437667-4&DocType=Customer+Drawing&DocLang=English; ComponentLink2Description: Digi-Key Listing; ComponentLink2URL: http://www.digikey.com/product-detail/en/te-connectivity-amp-connectors/4DB-P108-02/A98472-ND/1277921; Price: 0.99; Type: Barrier Block; Series: 4DB, Buchanan; Part Status: Active; Number Of Wire Entries: 2; Number Of Rows: 1; Features: -; Colour: Black; Terminal Screw Material: Steel; Terminal Screw Finish: Zinc, Clear Chromate; Mounting Type: Through Hole; Operating Temperature: 105C
J3 = 0022272041: CONN HEADER 4POS .100 VERT TIN; Manufacturer: Molex, LLC; Pitch: 0.100" (2.54mm); Number Of Positions: 4; Part Number: 0022272041; PartId: 9721; Supplier 1: Digi-Key; Supplier Part Number 1: WM4113-ND; ComponentLink1Description: Datasheet; ComponentLink1URL: http://www.molex.com/pdm_docs/sd/022272041_sd.pdf; ComponentLink2Description: Digi-Key Listing; ComponentLink2URL: http://www.digikey.com/product-search/en?keywords=22-27-2041; Price: 0.39; Type: Header, Unshrouded; Contact Finish: Tin; Fastening Type: Friction Lock; Number Of Rows: 1; Series: KK 6410
J4 = 20020110-D061A01LF: TERM BLOCK HDR 6POS R/A 3.81MM; Manufacturer: FCI; TemperatureRange: -40C ~ 115C; Voltage: 300V; Pitch: 0.150" (3.81mm); Number Of Positions: 6; Number Of Levels: 1; Part Number: 20020110-D061A01LF; PartId: 7789; Supplier 1: Digi-Key; Supplier Part Number 1: 609-3823-ND; ComponentLink1Description: Datasheet; ComponentLink1URL: http://portal.fciconnect.com/Comergent//fci/drawing/20020110.pdf; ComponentLink2Description: Digi-Key Listing; ComponentLink2URL: http://www.digikey.ca/product-detail/en/20020110-D061A01LF/609-3823-ND/2261282; Price: 1.61; Type: Through Hole; Colour: Green; Orientation: 90, Right Angle; Positions Per Level: 6
J5 = 20020110-D021A01LF: TERM BLOCK HDR 2POS R/A 3.81MM; Manufacturer: FCI; TemperatureRange: -40C ~ 115C; Voltage: 300V; Pitch: 0.150" (3.81mm); Number Of Positions: 2; Number Of Levels: 1; Part Number: 20020110-D021A01LF; PartId: 7785; Supplier 1: Digi-Key; Supplier Part Number 1: 609-3819-ND; ComponentLink1Description: Datasheet; ComponentLink1URL: http://portal.fciconnect.com/Comergent//fci/drawing/20020110.pdf; ComponentLink2Description: Digi-Key Listing; ComponentLink2URL: http://www.digikey.ca/product-detail/en/20020110-D021A01LF/609-3819-ND/2261255; Price: 0.75; Type: Through Hole; Colour: Green; Orientation: 90, Right Angle; Positions Per Level: 2
J6 = 4DB-P108-03: CONN BARRIER STRIP 3CIRC 0.325"; Manufacturer: TE Connectivity AMP Connectors; Number Of Circuits: 3; Pitch: 0.325" (8.26mm); Current Rating: 20A; Voltage: 150V; Wire Gauge: 12-22 AWG; Top Termination: Screws with Captive Plate; Bottom Termination: PC Pin; Barrier Type: 2 Wall (Dual); Part Number: 4DB-P108-03; PartId: 27457; Supplier 1: Digi-Key; Supplier Part Number 1: A98473-ND; Supplier 2: Digi-Key; Supplier Part Number 2: A98473-ND; Supplier 3: Digi-Key; Supplier Part Number 3: A98473-ND; Supplier 4: Digi-Key; Supplier Part Number 4: A98473-ND; ComponentLink1Description: Datasheet; ComponentLink1URL: http://www.te.com/commerce/DocumentDelivery/DDEController?Action=srchrtrv&DocNm=2-1437667-4&DocType=Customer+Drawing&DocLang=English; ComponentLink2Description: Digi-Key Listing; ComponentLink2URL: http://www.digikey.com/products/en?keywords=4DB-P108-03; Price: 1.13; Type: Barrier Block; Series: 4DB, Buchanan; Part Status: Active; Number Of Wire Entries: 3; Number Of Rows: 1; Features: -; Colour: Black; Terminal Screw Material: Steel; Terminal Screw Finish: Zinc, Clear Chromate; Mounting Type: Through Hole; Operating Temperature: 105C
J7 = 282834-2: TERM BLOCK 2POS SIDE ENT 2.54MM; Manufacturer: TE Connectivity AMP Connectors; TemperatureRange: -40C ~ 105C; Voltage: 150V; Pitch: 0.100" (2.54mm); Number Of Levels: 1; Positions Per Level: 2; Part Number: 282834-2; PartId: 9289; Supplier 1: Digi-Key; Supplier Part Number 1: A98333-ND; ComponentLink1Description: Datasheet; ComponentLink1URL: http://www.te.com/commerce/DocumentDelivery/DDEController?Action=srchrtrv&DocNm=282834&DocType=Customer+Drawing&DocLang=English; ComponentLink2Description: Digi-Key Listing; ComponentLink2URL: http://www.digikey.ca/product-detail/en/282834-2/A98333-ND/1150135; Price: 1.3; Colour: Green; Orientation: Horizontal with Board
J9 = 09061486901: DIN-POWER F048MS-3,0C1-2; Manufacturer: Harting; Number Of Positions: 48 (Power); Pitch: 0.200" (5.08mm); Style: F; Part Number: 09061486901; PartId: 27910; Supplier 1: Digi-Key; Supplier Part Number 1: 1195-1306-ND; ComponentLink1Description: Datasheet; ComponentLink1URL: https://b2b.harting.com/files/download/PRD/PDF_TS/0906148X901_100180101DRW107A.PDF; ComponentLink2Description: Digi-Key Listing; ComponentLink2URL: http://www.digikey.com/product-detail/en/harting/09061486901/1195-1306-ND/3179889; Operating Temperature: -; Price: 6.34; Type: Header, Male Pins; Part Status: Active; Series: DIN 41612; Number Of Rows: 3; Mounting Type: Through Hole, Right Angle; Termination: Solder; Features: -; Contact Finish: -
R1-R6 = ERJ-3GEYJ331V: RES SMD 330 OHM 5% 1/10W 0603; Manufacturer: Panasonic Electronic Components; TemperatureRange: -55C ~ 155C; TemperatureCoefficient: 200ppm/C; PowerRating: 0.1W, 1/10W; Value: 330; Part Number: ERJ-3GEYJ331V; PartId: 11189; Supplier 1: Digi-Key; Supplier Part Number 1: P330GTR-ND; ComponentLink1Description: Datasheet; ComponentLink1URL: http://industrial.panasonic.com/www-cgi/jvcr13pz.cgi?E+PZ+3+AOA0001+ERJ3GEYJ331V+7+WW; ComponentLink2Description: Digi-Key Listing; ComponentLink2URL: https://www.digikey.com/product-detail/en/panasonic-electronic-components/ERJ-3GEYJ331V/P330GTR-ND/135755; Tolerance: 5%; Price: 0.002; Device Package: 0603 (1608 Metric)
R26 = ERJ-3EKF5602V: RES SMD 56K OHM 1% 1/10W 0603; Manufacturer: Panasonic Electronic Components; TemperatureRange: -55C ~ 155C; TemperatureCoefficient: 100ppm/C; PowerRating: 0.1W, 1/10W; Value: 56k; Part Number: ERJ-3EKF5602V; PartId: 937; Supplier 1: Digi-Key; Supplier Part Number 1: P56.0KHTR-ND; ComponentLink1Description: Datasheet; ComponentLink1URL: http://industrial.panasonic.com/www-cgi/jvcr13pz.cgi?E+PZ+3+AOA0002+ERJ3EKF5602V+7+WW; ComponentLink2Description: Digi-Key listing; ComponentLink2URL: http://digikey.com/product-detail/en/ERJ-3EKF5602V/P56.0KHTR-ND/1746436; Tolerance: 1%; Price: 0.0038; Type: Thick Film; Device Package: 0603 (1608 Metric)
R27 = ERJ-3EKF1002V: RES SMD 10K OHM 1% 1/10W 0603; Manufacturer: Panasonic Electronic Components; TemperatureRange: -55C ~ 155C; TemperatureCoefficient: 100ppm/C; PowerRating: 0.1W, 1/10W; Value: 10k; Part Number: ERJ-3EKF1002V; PartId: 886; Supplier 1: Digi-Key; Supplier Part Number 1: P10.0KHTR-ND; ComponentLink1Description: Datasheet; ComponentLink1URL: http://industrial.panasonic.com/www-cgi/jvcr13pz.cgi?E+PZ+3+AOA0002+ERJ3EKF1002V+7+WW; ComponentLink2Description: Digi-Key listing; ComponentLink2URL: http://digikey.com/product-detail/en/ERJ-3EKF1002V/P10.0KHTR-ND/196066; Tolerance: 1%; Price: 0.0038; Type: Thick Film; Device Package: 0603 (1608 Metric)

## Sheet Power Supply.SchDoc: Power Supply
size Letter; DocumentNumber: 4; SheetNumber: 4; SheetTotal: 4
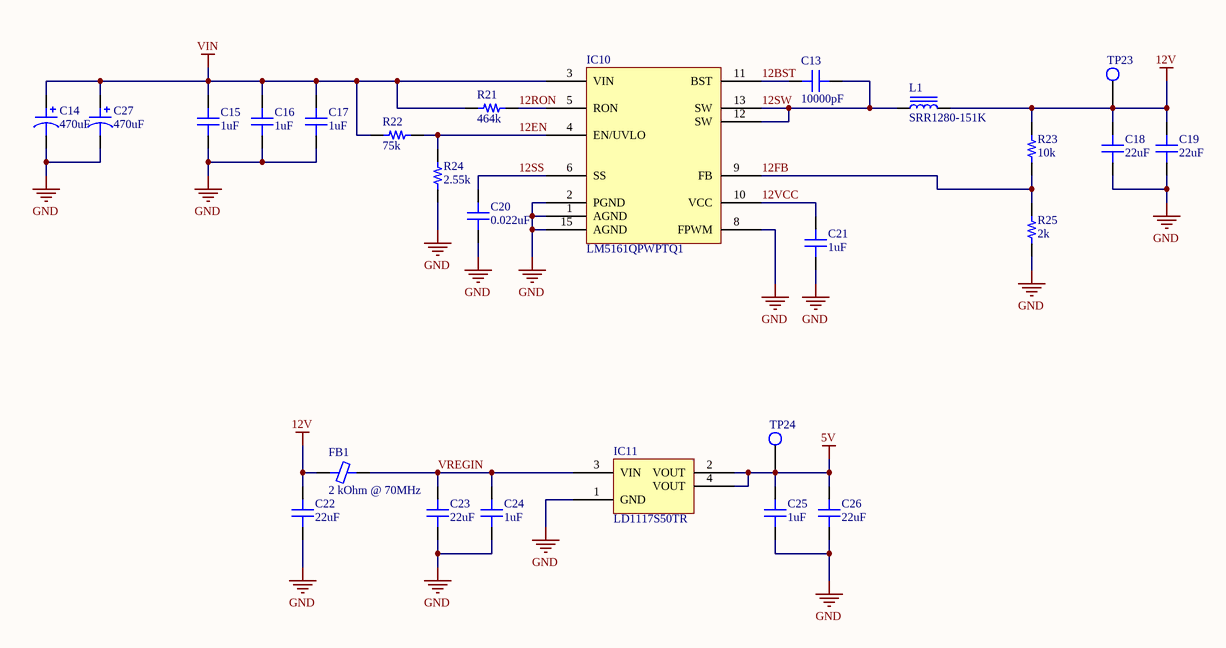
[diagram p3: Power Supply.SchDoc]

### Parts
C13  10000pF  [CAP 0603/1608]
C14  470uF  [CAP AL TH D25 L12.5 H32]
C15  1uF  [CAP 1812/4532 2.8MM]
C16  1uF  [CAP 1812/4532 2.8MM]
C17  1uF  [CAP 1812/4532 2.8MM]
C18  22uF  [CAP 1206/3216]
C19  22uF  [CAP 1206/3216]
C20  0.022uF  [CAP 0603/1608]
C21  1uF  [CAP 0603/1608]
C22  22uF  [CAP 1206/3216]
C23  22uF  [CAP 1206/3216]
C24  1uF  [CAP 0603/1608]
C25  1uF  [CAP 0603/1608]
C26  22uF  [CAP 1206/3216]
C27  470uF  [CAP AL TH D25 L12.5 H32]
FB1  2 kOhm @ 70MHz  [FER 0805/2012]
IC10  LM5161QPWPTQ1  [TI HTSSOP-14 PWP]
IC11  LD1117S50TR  [ST SOT-223]
L1  SRR1280-151K  [BOURNS SRR1280]
R21  464k  [RES 0603/1608]
R22  75k  [RES 0603/1608]
R23  10k  [RES 0603/1608]
R24  2.55k  [RES 0603/1608]
R25  2k  [RES 0603/1608]
TP23  Test Point  [Test Point]  (value not drawn)  (no BOM)
TP24  Test Point  [Test Point]  (value not drawn)  (no BOM)

### Nets
5V: C25.2 C26.2 IC11.2(VOUT) IC11.4(VOUT) TP24.1(TP)
12V: C18.2 C19.2 C22.2 FB1.1 L1.2 R23.2 TP23.1(TP)
GND: C14.2 C15.1 C16.1 C17.1 C18.1 C19.1 C20.1 C21.1 C22.1 C23.1 C24.1 C25.1 C26.1 C27.2 IC10.1(AGND) IC10.2(PGND) IC10.8(FPWM) IC10.15(AGND) IC11.1(GND) R24.1 R25.1
VIN: C14.1 C15.2 C16.2 C17.2 C27.1 IC10.3(VIN) R21.1 R22.2
12BST: C13.1 IC10.11(BST)
12EN: IC10.4(EN/UVLO) R22.1 R24.2
12FB: IC10.9(FB) R23.1 R25.2
12RON: IC10.5(RON) R21.2
12SS: C20.2 IC10.6(SS)
12SW: C13.2 IC10.12(SW) IC10.13(SW) L1.1
12VCC: C21.2 IC10.10(VCC)
VREGIN: C23.2 C24.2 FB1.2 IC11.3(VIN)

### Notes on the sheet
- Title
- Size:
- Date:
- Letter
- Number:
- Time:
- Revision:
- Sheet
- of
- File:

### Library data of the parts
C13 = CL10B103KB8NCNC: as C5 on sheet Controller; Value: 10000pF; Part Number: CL10B103KB8NCNC; PartId: 13008; Supplier 1: Digi-Key; Supplier Part Number 1: 1276-1921-2-ND; ComponentLink1Description: Datasheet; ComponentLink1URL: http://www.samsungsem.com/kr/support/library/product-catalog/__icsFiles/afieldfile/2015/11/18/MLCC.pdf; ComponentLink2Description: Digi-Key Listing; ComponentLink2URL: https://www.digikey.com/product-detail/en/samsung-electro-mechanics-america-inc/CL10B103KB8NCNC/1276-1921-2-ND/3887579; TemperatureCoefficient: X7R; Voltage: 50V; Price: 0.0032; Device Package: 0603 (1608 Metric)
C14 C27 = UVR2C471MRD6: CAP ALUM 470UF 20% 160V RADIAL; Manufacturer: Nichicon; TemperatureRange: -40C ~ 85C; Type: Polar; Ripple Current: 1.29A; Value: 470uF; Part Number: UVR2C471MRD6; PartId: 27481; Supplier 1: Digi-Key; Supplier Part Number 1: 493-1170-ND; ComponentLink1Description: Datasheet; ComponentLink1URL: http://nichicon-us.com/english/products/pdfs/e-uvr.pdf; ComponentLink2Description: Digi-Key Listing; ComponentLink2URL: https://www.digikey.com/product-detail/en/nichicon/UVR2C471MRD6/493-1170-ND/588911; Tolerance: 20%; Voltage: 160V; Price: 3.07; Device Package: Radial, Can, 25mm
C15-C17 = C4532X7T2E105M250KA: CAP CER 1UF 250V X7T 1812; Manufacturer: TDK Corporation; TemperatureRange: -55C ~ 125C; Tolerance: 20%; Value: 1uF; Part Number: C4532X7T2E105M250KA; PartId: 22233; Supplier 1: Digi-Key; Supplier Part Number 1: 445-13454-2-ND; ComponentLink1Description: Datasheet; ComponentLink1URL: https://product.tdk.com/info/en/catalog/datasheets/mlcc_commercial_midvoltage_en.pdf; ComponentLink2Description: Digi-Key Listing; ComponentLink2URL: https://www.digikey.com/product-detail/en/tdk-corporation/C4532X7T2E105M250KA/445-13454-2-ND/3950690; TemperatureCoefficient: X7T; Voltage: 250V; Price: 0.4522; Device Package: 1812 (4532 Metric)
C18 C19 C22 C23 C26 = CL31A226MOCLNNC: CAP CER 22UF 16V X5R 1206; Manufacturer: Samsung Electro-Mechanics America, Inc.; TemperatureRange: -55C ~ 85C; Tolerance: 20%; Value: 22uF; Part Number: CL31A226MOCLNNC; PartId: 15759; Supplier 1: Digi-Key; Supplier Part Number 1: 1276-2728-2-ND; ComponentLink1Description: Datasheet; ComponentLink1URL: //media.digikey.com/pdf/Data%20Sheets/Samsung%20PDFs/CL31A226MOCLNNC_Spec.pdf; ComponentLink2Description: Digi-Key Listing; ComponentLink2URL: https://www.digikey.com/product-detail/en/samsung-electro-mechanics-america-inc/CL31A226MOCLNNC/1276-2728-2-ND/3888386; TemperatureCoefficient: X5R; Voltage: 16V; Price: 0.0942; Device Package: 1206 (3216 Metric)
C20 = CL10B223KB8NNNC: CAP CER 0.022UF 50V X7R 0603; Manufacturer: Samsung Electro-Mechanics America, Inc.; TemperatureRange: -55C ~ 125C; Tolerance: 10%; Value: 0.022uF; Part Number: CL10B223KB8NNNC; PartId: 13210; Supplier 1: Digi-Key; Supplier Part Number 1: 1276-1104-2-ND; ComponentLink1Description: Datasheet; ComponentLink1URL: http://www.samsungsem.com/kr/support/product-search/mlcc/CL10B223KB8NNNC.jsp; ComponentLink2Description: Digi-Key Listing; ComponentLink2URL: https://www.digikey.com/product-detail/en/samsung-electro-mechanics-america-inc/CL10B223KB8NNNC/1276-1104-2-ND/3886762; TemperatureCoefficient: X7R; Voltage: 50V; Price: 0.0075; Device Package: 0603 (1608 Metric)
C21 C24 C25 = CL10A105KO8NNNC: CAP CER 1UF 16V X5R 0603; Manufacturer: Samsung Electro-Mechanics America, Inc.; TemperatureRange: -55C ~ 85C; Tolerance: 10%; Value: 1uF; Part Number: CL10A105KO8NNNC; PartId: 13125; Supplier 1: Digi-Key; Supplier Part Number 1: 1276-1034-2-ND; ComponentLink1Description: Datasheet; ComponentLink1URL: http://www.samsungsem.com/kr/support/product-search/mlcc/CL10A105KO8NNNC.jsp; ComponentLink2Description: Digi-Key Listing; ComponentLink2URL: https://www.digikey.com/product-detail/en/samsung-electro-mechanics-america-inc/CL10A105KO8NNNC/1276-1034-2-ND/3886692; TemperatureCoefficient: X5R; Voltage: 16V; Price: 0.0072; Device Package: 0603 (1608 Metric)
FB1 = CIM21J202NE: FERRITE CHIP 2000 OHM 500MA 0805; Manufacturer: Samsung Electro-Mechanics America, Inc.; Type: Differential Mode - Single; DC Resistance: 500 mOhm Max; Part Number: CIM21J202NE; PartId: 6754; Value: 2 kOhm @ 70MHz; Supplier 1: Digi-Key; Supplier Part Number 1: 1276-6330-2-ND; ComponentLink1Description: Datasheet; ComponentLink1URL: http://www.samsungsem.com/kr/front/downloadcms.do?path=/kr/support/product-search/bead/__icsFiles/afieldfile/2014/11/13&fileName=S_CIB21P110NE.pdf; ComponentLink2Description: Digi-Key listing; ComponentLink2URL: http://digikey.com/product-detail/en/CIM21J202NE/1276-6330-2-ND/3973930; Price: 0.013; Device Package: 0805 (2012 Metric); Current Rating: 500mA
IC10 = LM5161QPWPTQ1: IC REG BCK FLYBCK ISO 14HTSSOP; Manufacturer: Texas Instruments; Function: Step-Down; Output Configuration: Positive, Isolation Capable; Topology: Buck, Flyback; Output Type: Adjustable; Number Of Outputs: 1; Voltage - Input (Min): 4.5V; Voltage - Input (Max): 100V; Voltage - Output (Min/Fixed): 2V; Voltage - Output (Max): 92V; Current Output: 1A; Frequency - Switching: 50kHz ~ 1MHz; Synchronous Rectifier: Yes; Part Number: LM5161QPWPTQ1; PartId: 21612; Supplier 1: Digi-Key; Supplier Part Number 1: 296-44861-1-ND; ComponentLink1Description: Datasheet; ComponentLink1URL: http://www.ti.com/lit/ds/symlink/lm5161-q1.pdf; ComponentLink2Description: Digi-Key Listing; ComponentLink2URL: http://www.digikey.com/product-detail/en/texas-instruments/LM5161QPWPTQ1/296-44861-1-ND/6207399; Device Package: 14-TSSOP (0.173", 4.40mm Width) Exposed Pad; Price: 5.56; Series: Automotive, AEC-Q100; Operating Temperature: -40C ~ 150C (TJ)
IC11 = LD1117S50TR: IC REG LDO 5V 0.8A SOT223; Manufacturer: STMicroelectronics; Topology: Positive Fixed; Voltage Dropout: 1.1V @ 800mA; Voltage - Input: Up to 15V; Part Number: LD1117S50TR; PartId: 7964; Supplier 1: Digi-Key; Supplier Part Number 1: 497-6447-2-ND; ComponentLink1Description: Datasheet; ComponentLink1URL: http://www.st.com/web/en/resource/technical/document/datasheet/CD00000544.pdf; ComponentLink2Description: Digi-Key Listing; ComponentLink2URL: http://www.digikey.com/product-detail/en/LD1117S50TR/497-6447-2-ND/1038360; Price: 0.127; Device Package: TO-261-4, TO-261AA; Voltage - Output: 5V; Current - Limit (Min): -; Operating Temperature: 0C ~ 125C
L1 = SRR1280-151K: FIXED IND 150UH 1.85A 270 MOHM; Manufacturer: Bourns Inc.; Type: Wirewound; Material - Core: Ferrite; Tolerance: 10%; Current - Saturation: 1.9A; Shielding: Shielded; DC Resistance (DCR): 270 mOhm Max; Q @ Freq: 24 @ 796kHz; Frequency - Self Resonant: 4.1MHz; Value: 150uH; Part Number: SRR1280-151K; PartId: 15715; Supplier 1: Digi-Key; Supplier Part Number 1: SRR1280-151KTR-ND; ComponentLink1Description: Datasheet; ComponentLink1URL: http://www.bourns.com/docs/Product-Datasheets/SRR1280.pdf; ComponentLink2Description: Digi-Key Listing; ComponentLink2URL: https://www.digikey.com/product-detail/en/bourns-inc/SRR1280-151K/SRR1280-151KTR-ND/1970006; Price: 0.7737; Device Package: Nonstandard; Series: SRR1280; Inductance: 150uH; Current Rating: 1.85A; Operating Temperature: -40C ~ 125C
R21 = ERJ-3EKF4643V: RES SMD 464K OHM 1% 1/10W 0603; Manufacturer: Panasonic Electronic Components; TemperatureRange: -55C ~ 155C; TemperatureCoefficient: 100ppm/C; PowerRating: 0.1W, 1/10W; Value: 464k; Part Number: ERJ-3EKF4643V; PartId: 1218; Supplier 1: Digi-Key; Supplier Part Number 1: P464KHTR-ND; ComponentLink1Description: Datasheet; ComponentLink1URL: http://industrial.panasonic.com/www-cgi/jvcr13pz.cgi?E+PZ+3+AOA0002+ERJ3EKF4643V+7+WW; ComponentLink2Description: Digi-Key listing; ComponentLink2URL: http://digikey.com/product-detail/en/ERJ-3EKF4643V/P464KHTR-ND/196369; Tolerance: 1%; Price: 0.0038; Type: Thick Film; Device Package: 0603 (1608 Metric)
R22 = ERJ-3EKF7502V: RES SMD 75K OHM 1% 1/10W 0603; Manufacturer: Panasonic Electronic Components; TemperatureRange: -55C ~ 155C; TemperatureCoefficient: 100ppm/C; PowerRating: 0.1W, 1/10W; Value: 75k; Part Number: ERJ-3EKF7502V; PartId: 1059; Supplier 1: Digi-Key; Supplier Part Number 1: P75.0KHTR-ND; ComponentLink1Description: Datasheet; ComponentLink1URL: http://industrial.panasonic.com/www-cgi/jvcr13pz.cgi?E+PZ+3+AOA0002+ERJ3EKF7502V+7+WW; ComponentLink2Description: Digi-Key listing; ComponentLink2URL: http://digikey.com/product-detail/en/ERJ-3EKF7502V/P75.0KHTR-ND/196471; Tolerance: 1%; Price: 0.0038; Type: Thick Film; Device Package: 0603 (1608 Metric)
R23 = ERJ-3EKF1002V: as R27 on sheet Connectors; Value: 10k; Part Number: ERJ-3EKF1002V; PartId: 886; Supplier 1: Digi-Key; Supplier Part Number 1: P10.0KHTR-ND; ComponentLink1Description: Datasheet; ComponentLink1URL: http://industrial.panasonic.com/www-cgi/jvcr13pz.cgi?E+PZ+3+AOA0002+ERJ3EKF1002V+7+WW; ComponentLink2Description: Digi-Key listing; ComponentLink2URL: http://digikey.com/product-detail/en/ERJ-3EKF1002V/P10.0KHTR-ND/196066; Tolerance: 1%; Price: 0.0038; Type: Thick Film; Device Package: 0603 (1608 Metric)
R24 = ERJ-3EKF2551V: RES SMD 2.55K OHM 1% 1/10W 0603; Manufacturer: Panasonic Electronic Components; TemperatureRange: -55C ~ 155C; TemperatureCoefficient: 100ppm/C; PowerRating: 0.1W, 1/10W; Value: 2.55k; Part Number: ERJ-3EKF2551V; PartId: 1213; Supplier 1: Digi-Key; Supplier Part Number 1: P2.55KHTR-ND; ComponentLink1Description: Datasheet; ComponentLink1URL: http://industrial.panasonic.com/www-cgi/jvcr13pz.cgi?E+PZ+3+AOA0002+ERJ3EKF2551V+7+WW; ComponentLink2Description: Digi-Key listing; ComponentLink2URL: http://digikey.com/product-detail/en/ERJ-3EKF2551V/P2.55KHTR-ND/196193; Tolerance: 1%; Price: 0.0038; Type: Thick Film; Device Package: 0603 (1608 Metric)
R25 = ERJ-3EKF2001V: RES SMD 2K OHM 1% 1/10W 0603; Manufacturer: Panasonic Electronic Components; TemperatureRange: -55C ~ 155C; TemperatureCoefficient: 100ppm/C; PowerRating: 0.1W, 1/10W; Value: 2k; Part Number: ERJ-3EKF2001V; PartId: 898; Supplier 1: Digi-Key; Supplier Part Number 1: P2.00KHTR-ND; ComponentLink1Description: Datasheet; ComponentLink1URL: http://industrial.panasonic.com/www-cgi/jvcr13pz.cgi?E+PZ+3+AOA0002+ERJ3EKF2001V+7+WW; ComponentLink2Description: Digi-Key listing; ComponentLink2URL: http://digikey.com/product-detail/en/ERJ-3EKF2001V/P2.00KHTR-ND/196183; Tolerance: 1%; Price: 0.0038; Type: Thick Film; Device Package: 0603 (1608 Metric)

## Nets that join several sheets
5V: Controller (5 pins), Connectors (J1.1 J3.1 J4.1), Power Supply (5 pins)
12V: Controller (R9.1), HBridge (C8.2 C9.2 IC4.1 IC5.1), Connectors (7 pins), Power Supply (7 pins)
GND: Controller (11 pins), HBridge (5 pins), Connectors (11 pins), Power Supply (21 pins)
VIN: HBridge (D6.2 D7.2 IC6.D IC7.D), Connectors (9 pins), Power Supply (8 pins)
BRAKE_CTL: Controller (IC3.21), Connectors (IC2.1 IC12.1 TP11.1 TP25.1)
CSENSE: Controller (IC3.6), HBridge (6 pins)
DIR: Controller (IC3.18), Connectors (J9.D6 R3.2 TP7.1)
ENC_A: Controller (IC3.20), Connectors (J9.D7 R1.2 TP2.1)
ENC_B: Controller (IC3.19), Connectors (J9.Z6 R2.2 TP5.1)
ERROR: Controller (IC3.15), Connectors (J9.D8 R6.2 TP10.1)
MOT_A: HBridge (8 pins), Connectors (7 pins)
MOT_B: HBridge (8 pins), Connectors (7 pins)
MOTOR_HIN1: Controller (IC3.7), HBridge (IC4.2 TP19.1)
MOTOR_HIN2: Controller (IC3.1), HBridge (IC5.2 TP21.1)
MOTOR_LIN1: Controller (IC3.8), HBridge (IC4.3 TP20.1)
MOTOR_LIN2: Controller (IC3.2), HBridge (IC5.3 TP22.1)
RESET: Controller (IC3.16), Connectors (J9.D4 R5.2 TP9.1)
RXD: Controller (IC3.11), Connectors (J3.3 TP6.1)
STEP: Controller (IC3.17), Connectors (J9.D5 R4.2 TP8.1)
TXD: Controller (IC3.12), Connectors (J3.2 TP4.1)